# Altium schematic sheet CAN.SchDoc
size Letter; DocumentNumber: 4; SheetNumber: 4; SheetTotal: 7
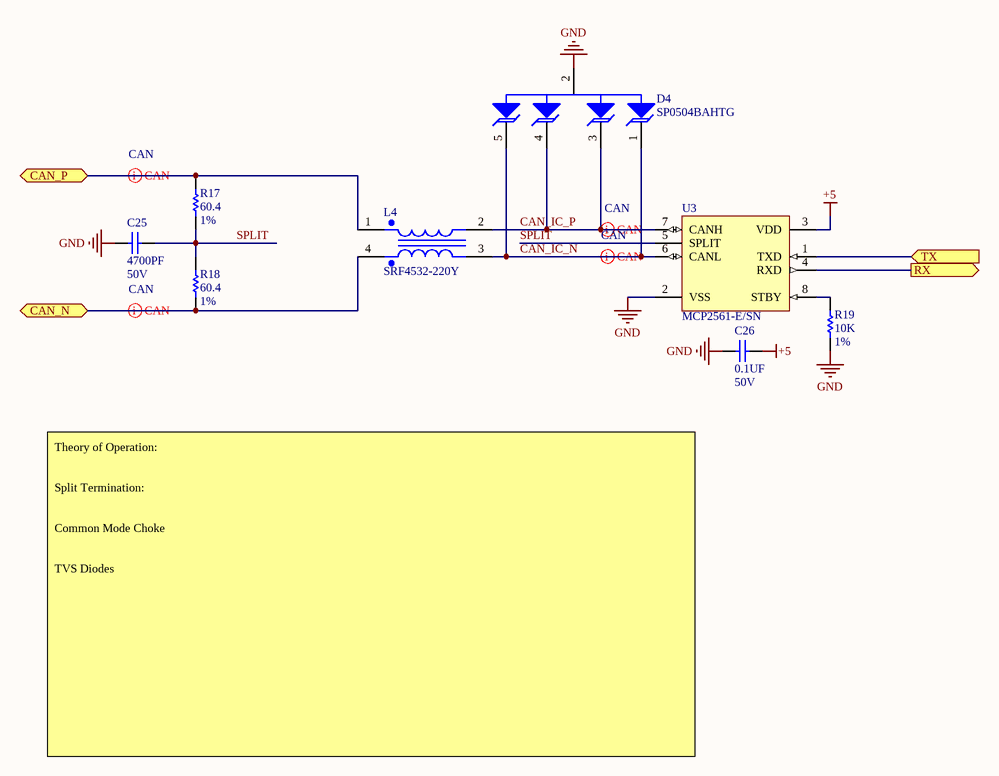
[diagram p0: CAN.SchDoc]

## Parts
C25  Val: 4700PF  Vol: 50V  [0603_CAP]  (hidden comment: CAP 0603 4700PF 50V 10% X7R)
C26  Val: 0.1UF  Vol: 50V  [0603_CAP]  (hidden comment: CAP 0603 0.1UF 50V 10% X7R)
D4  SP0504BAHTG  [SOT23127P600-8N]
L4  SRF4532-220Y  [IND_BOURNS_SRF45]
R17  Val: 60.4  Tol: 1%  [0805_RES]  (hidden comment: RES 0805 60.4 1%)
R18  Val: 60.4  Tol: 1%  [0805_RES]  (hidden comment: RES 0805 60.4 1%)
R19  Val: 10K  Tol: 1%  [0603_RES]  (hidden comment: RES 0603 10K 1%)
U3  MCP2561-E/SN  [Microchip_C04-2057A_0]

## Ports
CAN_N (bidir), CAN_P (bidir), RX (out), TX (in)

## Nets
+5: C26.2 U3.3(VDD)
GND: C25.1 C26.1 D4.2 R19.1 U3.2(VSS)
CAN_IC_N: D4.1 D4.5 L4.3 U3.6(CANL)
CAN_IC_P: D4.3 D4.4 L4.2 U3.7(CANH)
CAN_N: L4.4 R18.1 ; port CAN_N
CAN_P: L4.1 R17.2 ; port CAN_P
RX: U3.4(RXD) ; port RX
SPLIT: C25.2 R17.1 R18.2 U3.5(SPLIT)
TX: U3.1(TXD) ; port TX
NetR19_2: R19.2 U3.8(STBY)

## Layout directives
differential pair; differential pair class CAN: CAN_IC_N, CAN_IC_P, CAN_N, CAN_P

## Notes on the sheet
- Theory of Operation:
  Split Termination:
  Common Mode Choke
  TVS Diodes
- Title:
- Size:
- Date:
- Desc:
- Letter
- Auth:
- Sheet
- Proj:
- *
- of
- www.uvmaero.org
- File:

## Library data of the parts
C25 = CAP 0603 4700PF 50V 10% X7R: Capacitor Surface Mount 0603 Footprint 4700PF 50V 10% Tolerance Ceramic X7R; Manufacturer: Various; PCB Package: 0603; Description in Visual: Cap SMT 0603 4700PF 50V 10%  Cer X7R; P/N: CAP 0603 4700PF 50V 10% X7R; Manufacturer P/N: Various; Value: 4700PF; Voltage: 50V; Tolerance: 10%; Type: Ceramic X7R; ComponentLink1Description: Manufacturer Website; ComponentLink2Description: Component Datasheet; ComponentLink3Description: Octopart Link
C26 = CAP 0603 0.1UF 50V 10% X7R: Capacitor Surface Mount 0603 Footprint 0.1UF 50V 10% Tolerance Ceramic X7R; Manufacturer: Various; PCB Package: 0603; Description in Visual: Cap SMT 0603 0.1UF 50V 10%  Cer X7R; P/N: CAP 0603 0.1UF 50V 10% X7R; Manufacturer P/N: Various; Value: 0.1UF; Voltage: 50V; Tolerance: 10%; Type: Ceramic X7R; ComponentLink1Description: Manufacturer Website; ComponentLink2Description: Component Datasheet; ComponentLink3Description: Octopart Link
D4 = SP0504BAHTG: 8.5V Clamp  Ipp Tvs Diode Surface Mount SOT-23-5 5.5V; Manufacturer: Littelfuse; Capacitance: 30pF; Diode Type: Avalanche; Direction: Unidirectional; Element Configuration: Common Anode; ESD Protection: Yes; Leakage Current: 100nA; Max Power Dissipation: 225mW; Number of Channels: 4; Polarity: Bidirectional,Unidirectional; Power Line Protection: No; Voltage Rating (DC): 5V; Breakdown Voltage: 5.5V; Case/Package: SOT-23; Category: TVS Diodes; Clamping Voltage: 8.5V; Composition: Zener; Depth: 1.75mm; Height: 1.3mm; Lead Free: Lead Free; Length: 3.05mm; Manufacturer Part Number: SP0504BAHTG; Max Operating Temperature: 85°C; Max Reverse Leakage Current: 100nA; Min Operating Temperature: -40°C; Mount: Surface Mount; Number of Elements: 4; Number of Pins: 5; Number of Unidirectional Channels: 4; Packaging: Tape and Reel; Peak Pulse Power: 225mW; Power Dissipation: 225mW; Radiation Hardening: No; REACH SVHC: Unknown; Reverse Standoff Voltage: 5.5V; Termination: SMD/SMT; Width: 1.75mm; Working Voltage: 5.5V; Supplier 1: Digi-Key; Supplier Part Number 1: F3157CT-ND
L4 = SRF4532-220Y: 22µH @ 100kHz 2 Line Common Mode Choke Surface Mount 1 kOhms @ 10MHz 200mA DCR 2.65Ohm; Manufacturer: Bourns; Core Material: Ferrite; DC Resistance (DCR): 2.65R; Impedance: 1kR; Inductance: 22uH; Inductance Tolerance: -30%; Insulation Resistance: 10MR; Material: Steel; Number of Lines: 2; Tolerance: 50%; Case Code (Imperial): 1812; Case Code (Metric): 4532; Case/Package: 4532; Category: Fixed Inductors; Current: 200mA; Current Rating: 200mA; DC Current: 200mA; Depth: 3.4mm; Height: 0.118inch; Lead Free: Lead Free; Length: 4.5mm; Manufacturer Part Number: SRF4532-220Y; Max DC Current: 200mA; Max Operating Temperature: 125°C; Min Operating Temperature: -40°C; Mount: Surface Mount,PCB; Package Quantity: 1; Packaging: Tape and Reel; REACH SVHC: No SVHC; Resistance: 1kR; Self Resonant Frequency: 100kHz; Termination: SMD/SMT; Test Frequency: 100kHz; Width: 0.126inch
R17 R18 = RES 0805 60.4 1%: Resistor Surface Mount, 60.4 Ohms, 0805 Footprint, 1% Tolerance 0.125W; Manufacturer: Various; PCB Package: 0805; Description in Visual: Res SMT 60.4 0805  1%  0.125W; Value: 60.4; P/N: RES 0805 60.4 1%; Manufacturer P/N: Various; Power_Rating: 0.125W; Tolerance: 1%
R19 = RES 0603 10K 1%: Resistor Surface Mount, 10K Ohms, 0603 Footprint, 1% Tolerance 0.1W; Manufacturer: Various; PCB Package: 0603; Description in Visual: Res SMT 10K 0603  1%  0.1W; P/N: RES 0603 10K 1%; Manufacturer P/N: Various; Value: 10K; Power_Rating: 0.1W; Tolerance: 1%
U3 = MCP2561-E/SN: 1/1 Transceiver CANbus 8-SOIC; Manufacturer: Microchip; Voltage: 4.5V ~ 5.5V; Duplex: Full; Propagation Delay Time: 125 ns; Data Rate: 1 Mb/s; Mfg Package Ident: C04-2057A; Protocol: CAN; helpURL: https://upverter.com/upn/revision/7ae0784463458063/; ComponentLink2Description: Datasheet; Temperature: -40°C to +125°C; Package: C04-2057A; Supplier 2: Mouser; Supplier 1: Digi-Key; ComponentLink1URL: https://upverter.com/upn/revision/7ae0784463458063/; Supplier Part Number 2: 579-MCP2561-E/SN; Supplier Part Number 1: MCP2561-E/SN-ND; ComponentLink1Description: Upverter; ComponentLink2URL: https://upverter.com/datasheet/23625d8df5c60d1941db5c365e0a3694c4b69235.pdf; RoHS: TRUE; Mouser Part Number: 579-MCP2561-E/SN; Number of Drivers/Receivers: 1/1; Type: Transceiver; Temperature Range High: +125°C; Digikey Description: IC 1/1 Transceiver Full CAN 8-SOIC; Digikey Part Number: MCP2561-E/SN-ND; Lead Free: yes; Temperature Range Low: -40°C; Part Number: MCP2561-E/SN